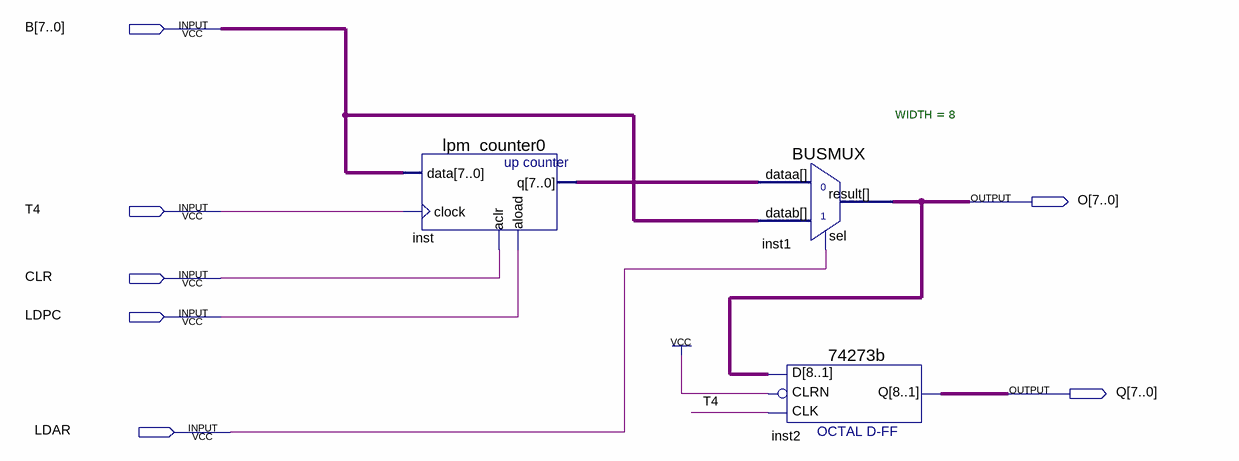
[diagram p0: schematic sheet]
// Quartus schematic bus.bdf as structural Verilog: 3 symbols, 7 pins
module bus (
  input  [7:0] B,
  input  T4,
  input  CLR,
  input  LDPC,
  input  LDAR,
  output [7:0] O,
  output [7:0] Q
);

  wire [7:0] inst_q;

  lpm_counter0 inst (.data(B), .clock(T4), .aclr(CLR), .aload(LDPC), .q(inst_q));
  BUSMUX #(.WIDTH(8)) inst1 (.datab(B), .sel(LDAR), .dataa(inst_q), .result(O));
  \74273b  inst2 (.CLK(T4), .D(O), .CLRN(1'b1), .Q(Q));
endmodule
